# Altium schematic sheet ResBottom.SchDoc
size A4; SheetNumber: 7; SheetTotal: 7
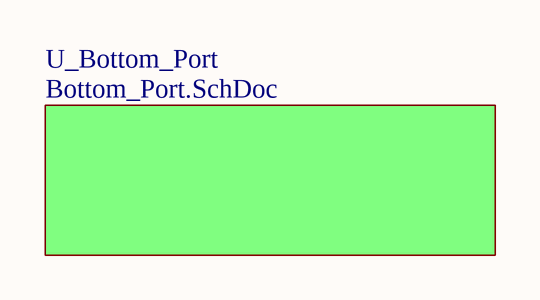
[diagram p0: ResBottom.SchDoc]

## Sub-sheets
U_Bottom_Port = Bottom_Port.SchDoc: no entries